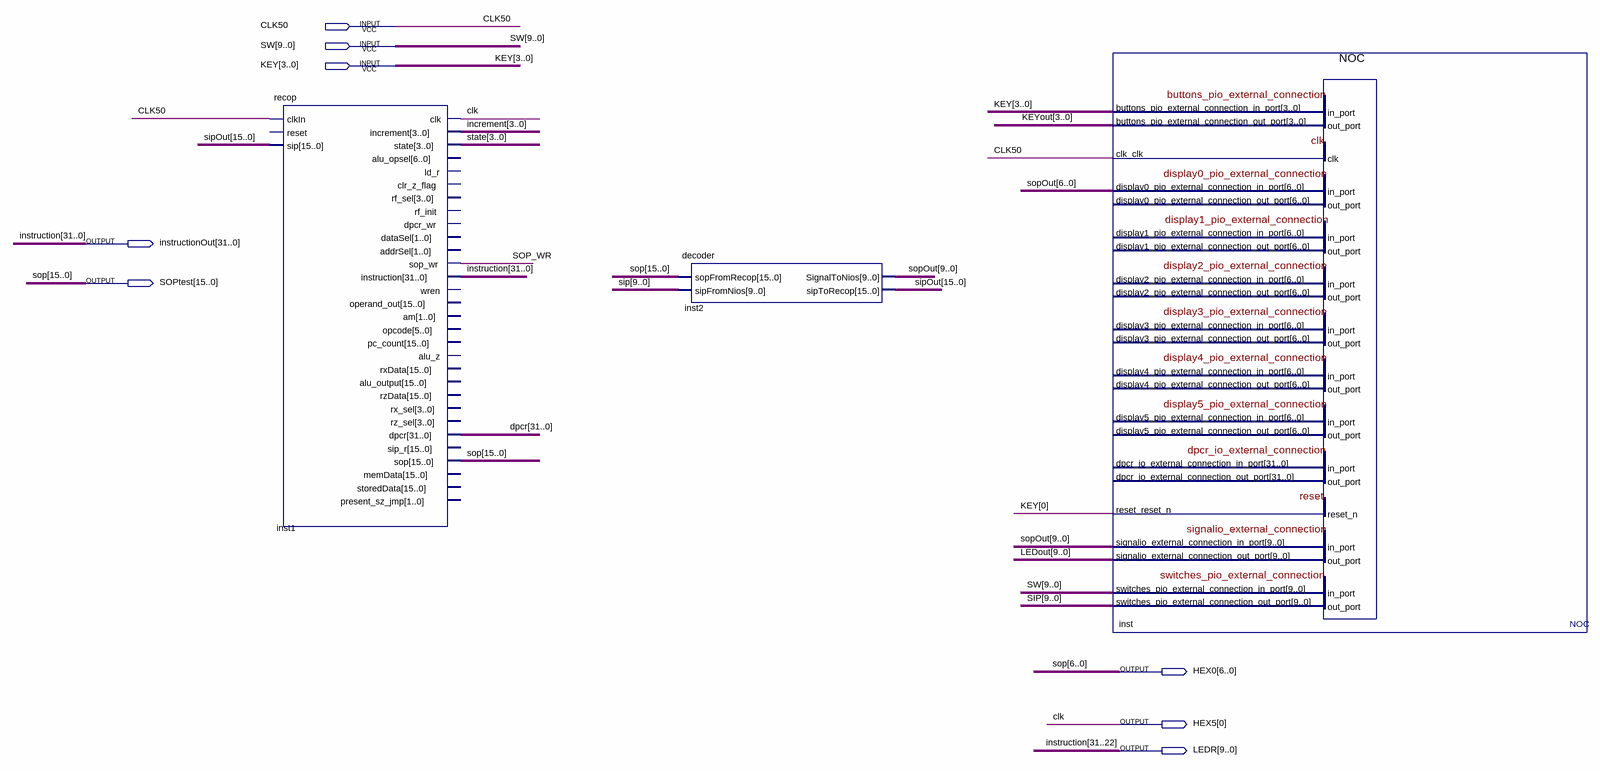
[diagram p0: schematic sheet]
// Quartus schematic top_level_block.bdf as structural Verilog: 3 symbols, 8 pins
module top_level_block (
  input  CLK50,
  input  [9:0] SW,
  input  [3:0] KEY,
  output [31:0] instructionOut,
  output [15:0] SOPtest,
  output [6:0] HEX0,
  output [0:0] HEX5,
  output [9:0] LEDR
);

  wire SOP_WR;
  wire [3:0] increment, KEYout, state;
  wire [9:0] LEDout, sip, sopOut;
  wire [15:0] sipOut;
  wire [31:0] dpcr;

  recop inst1 (
    .clkIn(CLK50), .sip(sipOut), .clk(HEX5[0]), .increment(increment), .state(state), .sop_wr(SOP_WR),
    .instruction(instructionOut), .dpcr(dpcr), .sop({SOPtest[15:7], HEX0}));  // open: reset, alu_opsel, ld_r, clr_z_flag, rf_sel, rf_init, dpcr_wr, dataSel, addrSel, wren, operand_out, am, opcode, pc_count, alu_z, rxData, alu_output, rzData, rx_sel, rz_sel, sip_r, memData, storedData, present_sz_jmp
  decoder inst2 (.sopFromRecop({SOPtest[15:7], HEX0}), .sipFromNios(sip), .SignalToNios(sopOut), .sipToRecop(sipOut));
  NOC inst (
    .buttons_pio_external_connection_in_port(KEY), .clk_clk(CLK50),
    .display0_pio_external_connection_in_port(sopOut[6:0]), .reset_reset_n(KEY[0]),
    .signalio_external_connection_in_port(sopOut), .switches_pio_external_connection_in_port(SW),
    .buttons_pio_external_connection_out_port(KEYout), .signalio_external_connection_out_port(LEDout),
    .switches_pio_external_connection_out_port(sip));  // open: display1_pio_external_connection_in_port, display2_pio_external_connection_in_port, display3_pio_external_connection_in_port, display4_pio_external_connection_in_port, display5_pio_external_connection_in_port, dpcr_io_external_connection_in_port, display0_pio_external_connection_out_port, display1_pio_external_connection_out_port, display2_pio_external_connection_out_port, display3_pio_external_connection_out_port, display4_pio_external_connection_out_port, display5_pio_external_connection_out_port, dpcr_io_external_connection_out_port

  assign LEDR = instructionOut[31:22];
  assign SOPtest[6:0] = HEX0;

  // Other names for the same wires on the sheet: clk = HEX5[0]; instruction[31:0] = instructionOut;
  //   sop[15:0] = {SOPtest[15:7], HEX0}
endmodule
